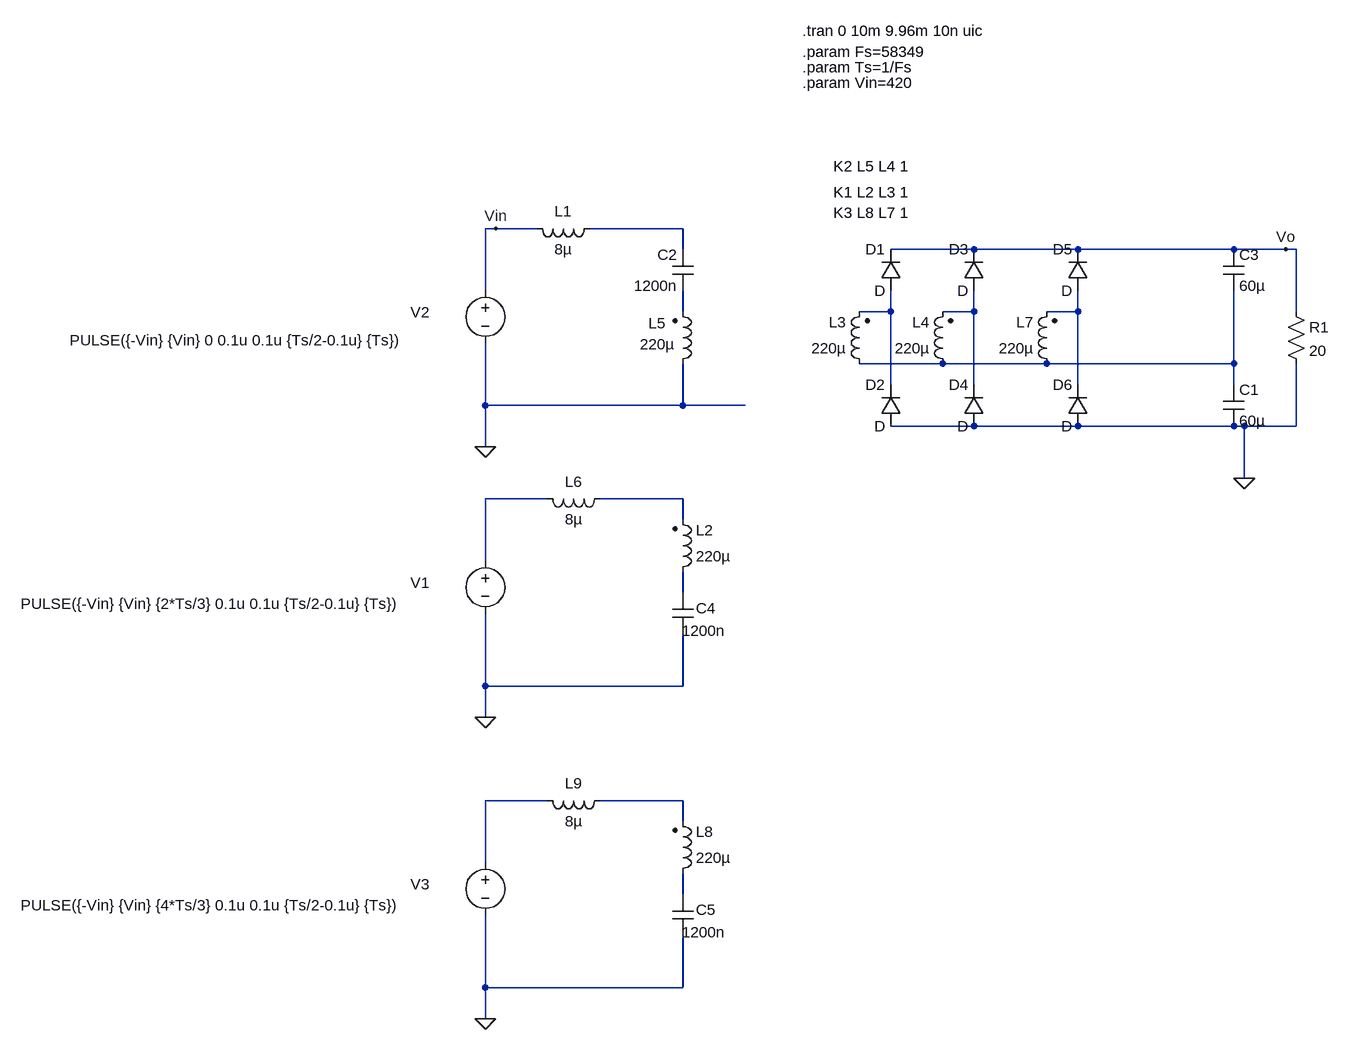
[diagram p0: schematic LLC 3-phase.asc]
LLC 3-phase.asc, the LTspice schematic file:
Version 4
SHEET 1 880 1140
WIRE -528 -96 -544 -96
WIRE -464 -96 -528 -96
WIRE -240 -96 -384 -96
WIRE -240 -64 -240 -96
WIRE 208 -64 80 -64
WIRE 368 -64 208 -64
WIRE 608 -64 368 -64
WIRE 688 -64 608 -64
WIRE 704 -64 688 -64
WIRE -544 0 -544 -96
WIRE -240 32 -240 0
WIRE 80 32 80 0
WIRE 80 32 32 32
WIRE 208 32 208 0
WIRE 208 32 160 32
WIRE 368 32 368 0
WIRE 368 32 320 32
WIRE 704 32 704 -64
WIRE 160 112 32 112
WIRE 320 112 160 112
WIRE 608 112 608 0
WIRE 608 112 320 112
WIRE 80 144 80 32
WIRE 208 144 208 32
WIRE 368 144 368 32
WIRE 608 144 608 112
WIRE -544 176 -544 80
WIRE -240 176 -240 112
WIRE -240 176 -544 176
WIRE -144 176 -240 176
WIRE 208 208 80 208
WIRE 368 208 208 208
WIRE 608 208 368 208
WIRE 624 208 608 208
WIRE 704 208 704 112
WIRE 704 208 624 208
WIRE -544 240 -544 176
WIRE 624 288 624 208
WIRE -448 320 -544 320
WIRE -240 320 -368 320
WIRE -240 352 -240 320
WIRE -544 416 -544 320
WIRE -240 464 -240 432
WIRE -544 608 -544 496
WIRE -240 608 -240 528
WIRE -240 608 -544 608
WIRE -544 656 -544 608
WIRE -448 784 -544 784
WIRE -240 784 -368 784
WIRE -240 816 -240 784
WIRE -544 880 -544 784
WIRE -240 928 -240 896
WIRE -544 1072 -544 960
WIRE -240 1072 -240 992
WIRE -240 1072 -544 1072
WIRE -544 1120 -544 1072
FLAG 624 288 0
FLAG 688 -64 Vo
FLAG -544 240 0
FLAG -528 -96 Vin
FLAG -544 656 0
FLAG -544 1120 0
SYMBOL ind -480 -112 M90
WINDOW 0 5 56 VBottom 2
WINDOW 3 32 56 VTop 2
SYMATTR InstName L1
SYMATTR Value 8µ
SYMBOL ind2 -256 448 M180
WINDOW 0 36 80 Left 2
WINDOW 3 36 40 Left 2
SYMATTR InstName L2
SYMATTR Value 220µ
SYMATTR Type ind
SYMBOL ind2 48 128 R180
WINDOW 0 36 80 Left 2
WINDOW 3 36 40 Left 2
SYMATTR InstName L3
SYMATTR Value 220µ
SYMATTR Type ind
SYMBOL diode 96 0 R180
WINDOW 0 24 64 Left 2
WINDOW 3 24 0 Left 2
SYMATTR InstName D1
SYMBOL cap 592 144 R0
SYMATTR InstName C1
SYMATTR Value 60µ
SYMBOL res 688 16 R0
SYMATTR InstName R1
SYMATTR Value 20
SYMBOL diode 96 208 R180
WINDOW 0 24 64 Left 2
WINDOW 3 24 0 Left 2
SYMATTR InstName D2
SYMBOL cap -224 0 R180
WINDOW 0 24 56 Left 2
WINDOW 3 24 8 Left 2
SYMATTR InstName C2
SYMATTR Value 1200n
SYMBOL cap 592 -64 R0
SYMATTR InstName C3
SYMATTR Value 60µ
SYMBOL diode 224 0 R180
WINDOW 0 24 64 Left 2
WINDOW 3 24 0 Left 2
SYMATTR InstName D3
SYMBOL diode 224 208 R180
WINDOW 0 24 64 Left 2
WINDOW 3 24 0 Left 2
SYMATTR InstName D4
SYMBOL ind2 176 128 R180
WINDOW 0 36 80 Left 2
WINDOW 3 36 40 Left 2
SYMATTR InstName L4
SYMATTR Value 220µ
SYMATTR Type ind
SYMBOL ind2 -256 128 M180
WINDOW 0 -37 78 Left 2
WINDOW 3 -50 46 Left 2
SYMATTR InstName L5
SYMATTR Value 220µ
SYMATTR Type ind
SYMBOL cap -224 528 R180
WINDOW 0 -35 40 Left 2
WINDOW 3 -50 5 Left 2
SYMATTR InstName C4
SYMATTR Value 1200n
SYMBOL voltage -544 -16 R0
WINDOW 123 0 0 Left 0
WINDOW 39 0 0 Left 0
WINDOW 3 -640 92 Left 2
WINDOW 0 -115 49 Left 2
SYMATTR Value PULSE({-Vin} {Vin} 0 0.1u 0.1u {Ts/2-0.1u} {Ts})
SYMATTR InstName V2
SYMBOL voltage -544 400 R0
WINDOW 123 0 0 Left 0
WINDOW 39 0 0 Left 0
WINDOW 3 -715 81 Left 2
WINDOW 0 -115 49 Left 2
SYMATTR Value PULSE({-Vin} {Vin} {2*Ts/3} 0.1u 0.1u {Ts/2-0.1u} {Ts})
SYMATTR InstName V1
SYMBOL ind -464 304 M90
WINDOW 0 5 56 VBottom 2
WINDOW 3 32 56 VTop 2
SYMATTR InstName L6
SYMATTR Value 8µ
SYMBOL diode 384 0 R180
WINDOW 0 24 64 Left 2
WINDOW 3 24 0 Left 2
SYMATTR InstName D5
SYMBOL diode 384 208 R180
WINDOW 0 24 64 Left 2
WINDOW 3 24 0 Left 2
SYMATTR InstName D6
SYMBOL ind2 336 128 R180
WINDOW 0 36 80 Left 2
WINDOW 3 36 40 Left 2
SYMATTR InstName L7
SYMATTR Value 220µ
SYMATTR Type ind
SYMBOL ind2 -256 912 M180
WINDOW 0 36 80 Left 2
WINDOW 3 36 40 Left 2
SYMATTR InstName L8
SYMATTR Value 220µ
SYMATTR Type ind
SYMBOL cap -224 992 R180
WINDOW 0 -35 40 Left 2
WINDOW 3 -50 5 Left 2
SYMATTR InstName C5
SYMATTR Value 1200n
SYMBOL voltage -544 864 R0
WINDOW 123 0 0 Left 0
WINDOW 39 0 0 Left 0
WINDOW 3 -715 81 Left 2
WINDOW 0 -115 49 Left 2
SYMATTR Value PULSE({-Vin} {Vin} {4*Ts/3} 0.1u 0.1u {Ts/2-0.1u} {Ts})
SYMATTR InstName V3
SYMBOL ind -464 768 M90
WINDOW 0 5 56 VBottom 2
WINDOW 3 32 56 VTop 2
SYMATTR InstName L9
SYMATTR Value 8µ
TEXT -8 -152 Left 2 !K1 L2 L3 1
TEXT -8 -192 Left 2 !K2 L5 L4 1
TEXT -56 -400 Left 2 !.tran 0 10m 9.96m 10n uic
TEXT -56 -368 Left 2 !.param Fs=58349
TEXT -56 -344 Left 2 !.param Ts=1/Fs
TEXT -56 -320 Left 2 !.param Vin=420
TEXT -8 -120 Left 2 !K3 L8 L7 1

The netlist it stands for:
* LLC 3-phase.asc
L1 Vin N001 8µ
L2 N009 N008 220µ
L3 N006 N003 220µ
D1 N003 Vo D
C1 N006 0 60µ
R1 Vo 0 20
D2 0 N003 D
C2 N002 N001 1200n
C3 Vo N006 60µ
D3 N004 Vo D
D4 0 N004 D
L4 N006 N004 220µ
L5 0 N002 220µ
C4 0 N009 1200n
V2 Vin 0 PULSE({-Vin} {Vin} 0 0.1u 0.1u {Ts/2-0.1u} {Ts})
V1 N007 0 PULSE({-Vin} {Vin} {2*Ts/3} 0.1u 0.1u {Ts/2-0.1u} {Ts})
L6 N007 N008 8µ
D5 N005 Vo D
D6 0 N005 D
L7 N006 N005 220µ
L8 N012 N011 220µ
C5 0 N012 1200n
V3 N010 0 PULSE({-Vin} {Vin} {4*Ts/3} 0.1u 0.1u {Ts/2-0.1u} {Ts})
L9 N010 N011 8µ
.model D D
.lib standard.dio
K1 L2 L3 1
K2 L5 L4 1
.tran 0 10m 9.96m 10n uic
.param Fs=58349
.param Ts=1/Fs
.param Vin=420
K3 L8 L7 1
.backanno
.end